# Altium schematic sheet leds_mem_sensor.SchDoc: Fine Delay FMC
size 297 x 209 mm; CheckedBy: B. Civel; CompanyName: CERN; DrawnBy: TW, GK; Engineer: TW; Organization: CERN; Address1: European Organization for Nuclear Research; Address2: CH-1211 Geneve 23 - Switzerland; DocumentNumber: 4; Revision: -; SheetNumber: 4; SheetTotal: 10; ModifiedBy: B. Civel; CreateDate: 18/01/2012; CheckedDate: 06/06/2013; Title2: LEDs, sensors and ID EEPROM; Designer: TW, GK; EDA_Number: EDA-02267-V6-1; Projet: Fine Delay FMC (FMCDel1ns4cha); DivGrp: BE-CO; ModifiedDate: 16/08/2012
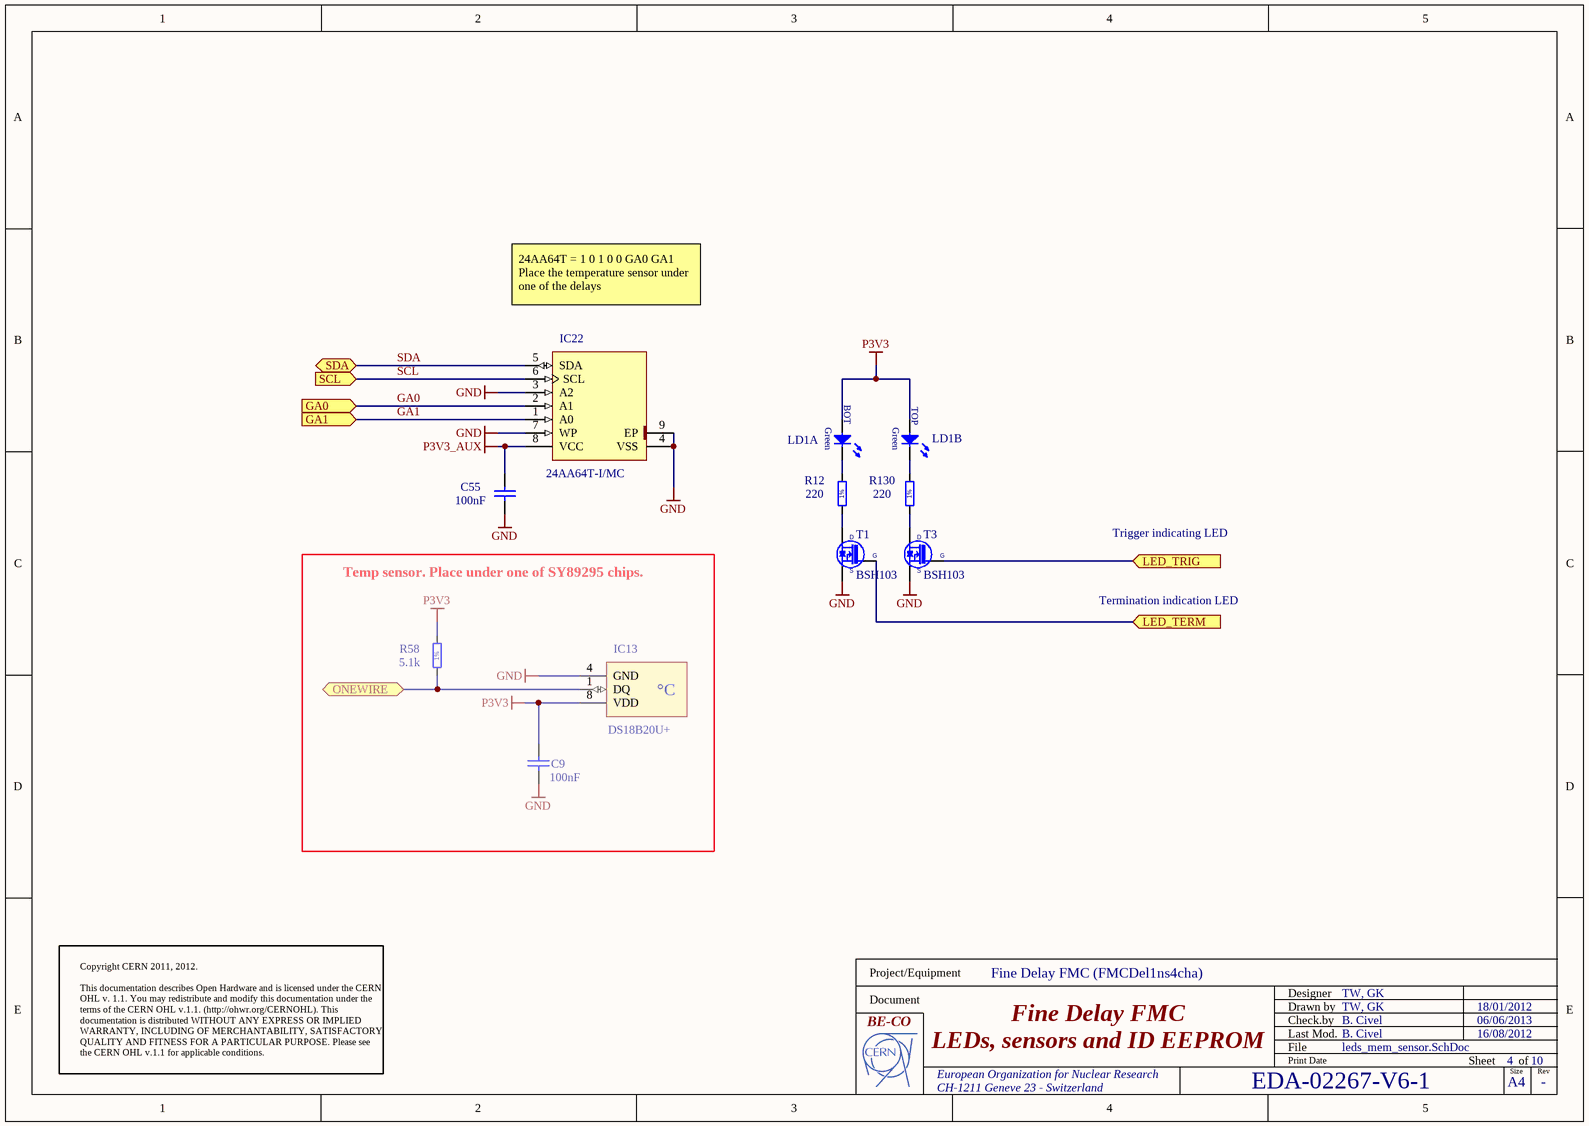
[diagram p0: leds_mem_sensor.SchDoc]

## Parts
C9  100nF  [CAPC1608X87N]
C55  100nF  [CAPC1608X87N]
IC13  DS18B20U+  [SOP65P490X110-8N]
IC22  24AA64T-I/MC  [SON50P300X200X100-9N-S175X155]
LD1  Green/Green  [LED_DIALIGHT_571-0122-100F]  (value not drawn)  (parts A,B of 2)
R12  220  [RESC1608X55N]
R58  5.1k  [RESC1608X55N]
R130  220  [RESC1608X55N]
T1  BSH103  [SOT95P230X110-3N]
T3  BSH103  [SOT95P230X110-3N]

## Blocks framed on the sheet
Temp sensor. Place under one of SY89295 chips.: C9 IC13 R58

## Ports
GA0 (in), GA1 (in), LED_TERM (in), LED_TRIG (in), ONEWIRE (bidir), SCL (in), SDA (bidir)

## Nets
GND: C9.2 C55.2 IC13.4(GND) IC22.3(A2) IC22.4(VSS) IC22.7(WP) IC22.9(EP) T1.2(S) T3.2(S)
P3V3: C9.1 IC13.8(VDD) LD1.2(A) LD1.4(A) R58.2
P3V3_AUX: C55.1 IC22.8(VCC)
GA0: IC22.2(A1) ; port GA0
GA1: IC22.1(A0) ; port GA1
LED_TERM: T1.1(G) ; port LED_TERM
LED_TRIG: T3.1(G) ; port LED_TRIG
ONEWIRE: IC13.1(DQ) R58.1 ; port ONEWIRE
SCL: IC22.6(SCL) ; port SCL
SDA: IC22.5(SDA) ; port SDA
NetLD1_1: LD1.1(C) R12.2
NetLD1_3: LD1.3(C) R130.2
NetR12_1: R12.1 T1.3(D)
NetR130_1: R130.1 T3.3(D)

## Notes on the sheet
- 24AA64T = 1 0 1 0 0 GA0 GA1
  Place the temperature sensor under one of the delays
- Trigger indicating LED
- Termination indication LED
- Copyright CERN 2011, 2012.
  This documentation describes Open Hardware and is licensed under the CERN OHL v. 1.1. You may redistribute and modify this documentation under the terms of the CERN OHL v.1.1. (http://ohwr.org/CERNOHL). This documentation is distributed WITHOUT ANY EXPRESS OR IMPLIED WARRANTY, INCLUDING OF MERCHANTABILITY, SATISFACTORY QUALITY AND FITNESS FOR A PARTICULAR PURPOSE. Please see the CERN OHL v.1.1 for applicable conditions.
- Project/Equipment
- Document
- Designer
- Drawn by
- Check.by
- File
- Last Mod.
- Print Date
- Sheet
- Size
- A4
- of
- Rev
- (in symbol DS18B20U+) °C
- (in symbol LED_DIALIGHT_571-0122-100F, part A) BOT; Green
- (in symbol LED_DIALIGHT_571-0122-100F, part B) TOP; Green
- (in symbol R0603_5K1_1%_0.1W_100PPM) 1%
- (in symbol R0603_220R_1%_0.1W_100PPM) 1%

## Library data of the parts
C9 C55 = CC0603_100NF_50V_10%_X7R: Non-polarised capacitor; Part Description: SMD Multilayer Chip Ceramic Capacitor; Manufacturer: GENERIC; Manufacturer1 Part Number: 223858615649; Voltage: 50V; TC: X7R; Tolerance: ±10%; Table: Capacitors SMD; Part Number: CC0603_100NF_50V_10%_X7R; Component Kind: Standard; Component Type: Standard; Pin Count: 2; Value: 100nF; Status: Preferred; Manufacturer Part Number: CC0603_100NF_50V_10%_X7R; Case: 0603; Mounted: Yes; Socket: No; SMD: Yes; Manufacturer1 Example: PHYCOMP; Manufacturer1 ComponentHeight: 0.87mm; HelpURL: \\cern.ch\dfs\Applications\Altium\Datasheets\CC0603_X7R_PHYCOMP.pdf; Author: CERN DEM JLC; CreateDate: 03/12/2007; LatestRevisionDate: 03/12/2007
IC13 = DS18B20U+: Programmable Resolution 1-Wire Digital Thermometer; Part Description: Programmable Resolution 1-Wire Digital Thermometer (-55°C to +125°C); Manufacturer: DALLAS MAXIM; Table: Sensors; PressFit: No; Bonding: No; Part Number: DS18B20U+; Component Kind: Standard; Component Type: Standard; Device: DS18B20U+; PackageDescription: SOP, 0.65mm pitch; 8 pin, 3.00mm W X 3.00mm L X 1.10mm H body, IPC Medium Density; Manufacturer Part Number: DS18B20U+; Pin Count: 3; Case: uSOP8; Mounted: Yes; Socket: No; SMD: Yes; ComponentHeight: 1.1mm; HelpURL: \\cern.ch\dfs\Applications\Altium\Datasheets\DS18B20U+.pdf; Author: CERN DEM JLC; CreateDate: 17/03/2010; LatestRevisionDate: 02/05/2011
IC22 = 24AA64T-I/MC: 1.7-5.5V 64K I2C Serial EEPROM; Part Description: 1.7V-5.5V, 64K  (8K x 8-bit) I2C Serial EEPROM; Manufacturer: MICROCHIP TECHNOLOGY; Table: Logic; PressFit: No; Bonding: No; Part Number: 24AA64T-I/MC; Component Kind: Standard; Component Type: Standard; Device: 24AA64T-I/MC; PackageDescription: SON (DFN), 0.50mm pitch, 8 pin, 2mm X 3mm X 1.00mm H body (w/thermal tab 1.75 X 1.55mm),  IPC Medium Density; Manufacturer Part Number: 24AA64T-I/MC; Pin Count: 9; Case: DFN8; Mounted: Yes; Socket: No; SMD: Yes; ComponentHeight: 1.0mm; HelpURL: \\cern.ch\dfs\Applications\Altium\Datasheets\24AA64T-I-MC.pdf; Author: CERN DEM JLC; CreateDate: 18/11/2009; LatestRevisionDate: 24/01/2011
LD1 = LED_DIALIGHT_571-0122-100F: LED x2 Green 1C2A-BOT_3C4A-TOP; Part Description: Dual 2mm Green LEDs CBI® Circuit Board Indicator (With positioning pins); Table: LEDs & Displays; PressFit: No; Bonding: No; Part Number: LED_DIALIGHT_571-0122-100F; Component Kind: Standard; Component Type: Standard; Color: Green/Green; PackageDescription: 2x 2mm Red LED PCB Edge Mounting (With positioning pins) DIALIGHT 571 Serie; Manufacturer: DIALIGHT; Manufacturer Part Number: 571-0122-100F; Pin Count: 4; Mounted: Yes; Socket: No; SMD: No; ComponentHeight: 8.6mm; HelpURL: \\cern.ch\dfs\Applications\Altium\Datasheets\LED_DIALIGHT_571-0122-100F.pdf; Author: CERN DEM JLC; CreateDate: 05/11/2009; LatestRevisionDate: 17/03/2010
R12 R130 = R0603_220R_1%_0.1W_100PPM: Resistor - 1%; Part Description: General Purpose Thick Film Chip Resistor; Manufacturer: GENERIC; Manufacturer1 Part Number: NRC06F2200TRF; Power: 0.1W; TC: ±100ppm/°C; Table: Resistors SMD; Part Number: R0603_220R_1%_0.1W_100PPM; Component Kind: Standard; Component Type: Standard; Pin Count: 2; Value: 220; Status: Preferred; Tolerance: ±1%; Manufacturer Part Number: R0603_220R_1%_0.1W_100PPM; Case: 0603; Mounted: Yes; Socket: No; SMD: Yes; Manufacturer1 Example: NIC COMPONENT; Manufacturer1 ComponentHeight: 0.55mm; HelpURL: \\cern.ch\dfs\Applications\Altium\Datasheets\R0603_NIC_NRC.pdf; Author: CERN DEM JLC; CreateDate: 12/3/2007; LatestRevisionDate: 3/13/2008
R58 = R0603_5K1_1%_0.1W_100PPM: Resistor - 1%; Part Description: General Purpose Thick Film Chip Resistor; Manufacturer: GENERIC; Manufacturer1 Part Number: NRC06F5101TRF; Value: 5k1; Power: 0.1W; TC: ±100ppm/°C; Table: Resistors SMD; Part Number: R0603_5K1_1%_0.1W_100PPM; Component Kind: Standard; Component Type: Standard; Designator: Resistor - 1%; Library Reference: Resistor - 1%; Pin Count: 2; Status: Preferred; Tolerance: ±1%; Manufacturer Part Number: R0603_5K1_1%_0.1W_100PPM; Case: 0603; Mounted: Yes; Socket: No; SMD: Yes; Manufacturer1 Example: NIC COMPONENT; Manufacturer1 ComponentHeight: 0.55mm; HelpURL: \\cern.ch\dfs\Applications\Altium\Datasheets\R0603_NIC_NRC.pdf; Author: CERN DEM JLC; CreateDate: 12/3/2007; LatestRevisionDate: 3/13/2008
T1 T3 = BSH103: N-CHANNEL MOSFET WITH DIODE; Part Description: 30V 850mA N-Channel Enhancement Mode Field-Effect Transistor; Manufacturer: NXP SEMICONDUCTORS; Table: Transistors; PressFit: No; Bonding: No; Part Number: BSH103; Component Kind: Standard; Component Type: Standard; Device: BSH103; PackageDescription: SOT23, 3 pin, Pitch 0.95mm - 1.3mm W X 2.9mm L X 1.1mm H, IPC Medium Density; Manufacturer Part Number: BSH103; Pin Count: 3; Case: SOT23-3; Mounted: Yes; Socket: No; SMD: Yes; ComponentHeight: 1.1mm; HelpURL: \\cern.ch\dfs\Applications\Altium\Datasheets\BSH103.pdf; Author: CERN DEM JLC; CreateDate: 16/03/2010; LatestRevisionDate: 01/02/2012